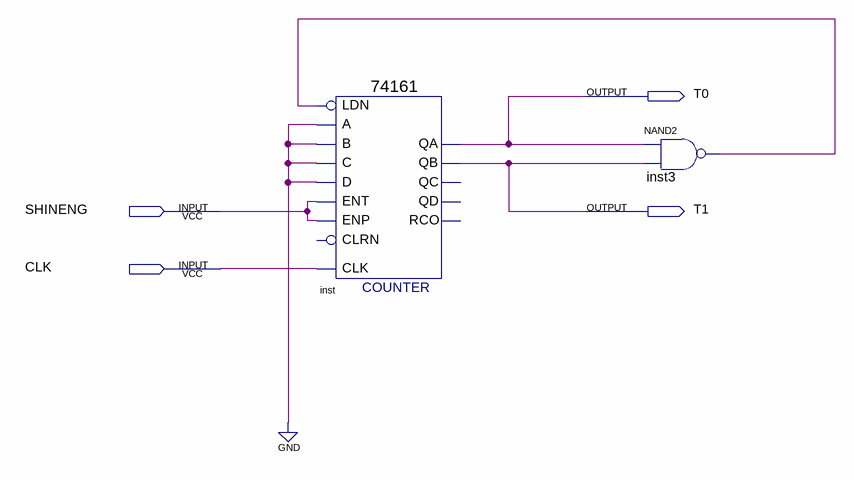
[diagram p0: schematic sheet]
// Quartus schematic control.bdf as structural Verilog: 2 symbols, 4 pins
module control (
  input  SHINENG,
  input  CLK,
  output T0,
  output T1
);

  wire inst3_out;

  \74161  inst (
    .CLK(CLK), .ENP(SHINENG), .LDN(inst3_out), .A(1'b0), .D(1'b0), .ENT(SHINENG), .B(1'b0), .C(1'b0),
    .QB(T1), .QA(T0));  // open: CLRN, QD, QC, RCO
  nand inst3 (inst3_out, T0, T1);
endmodule
